# EAGLE design mini_Quad_v01 (EAGLE 9.0.1)
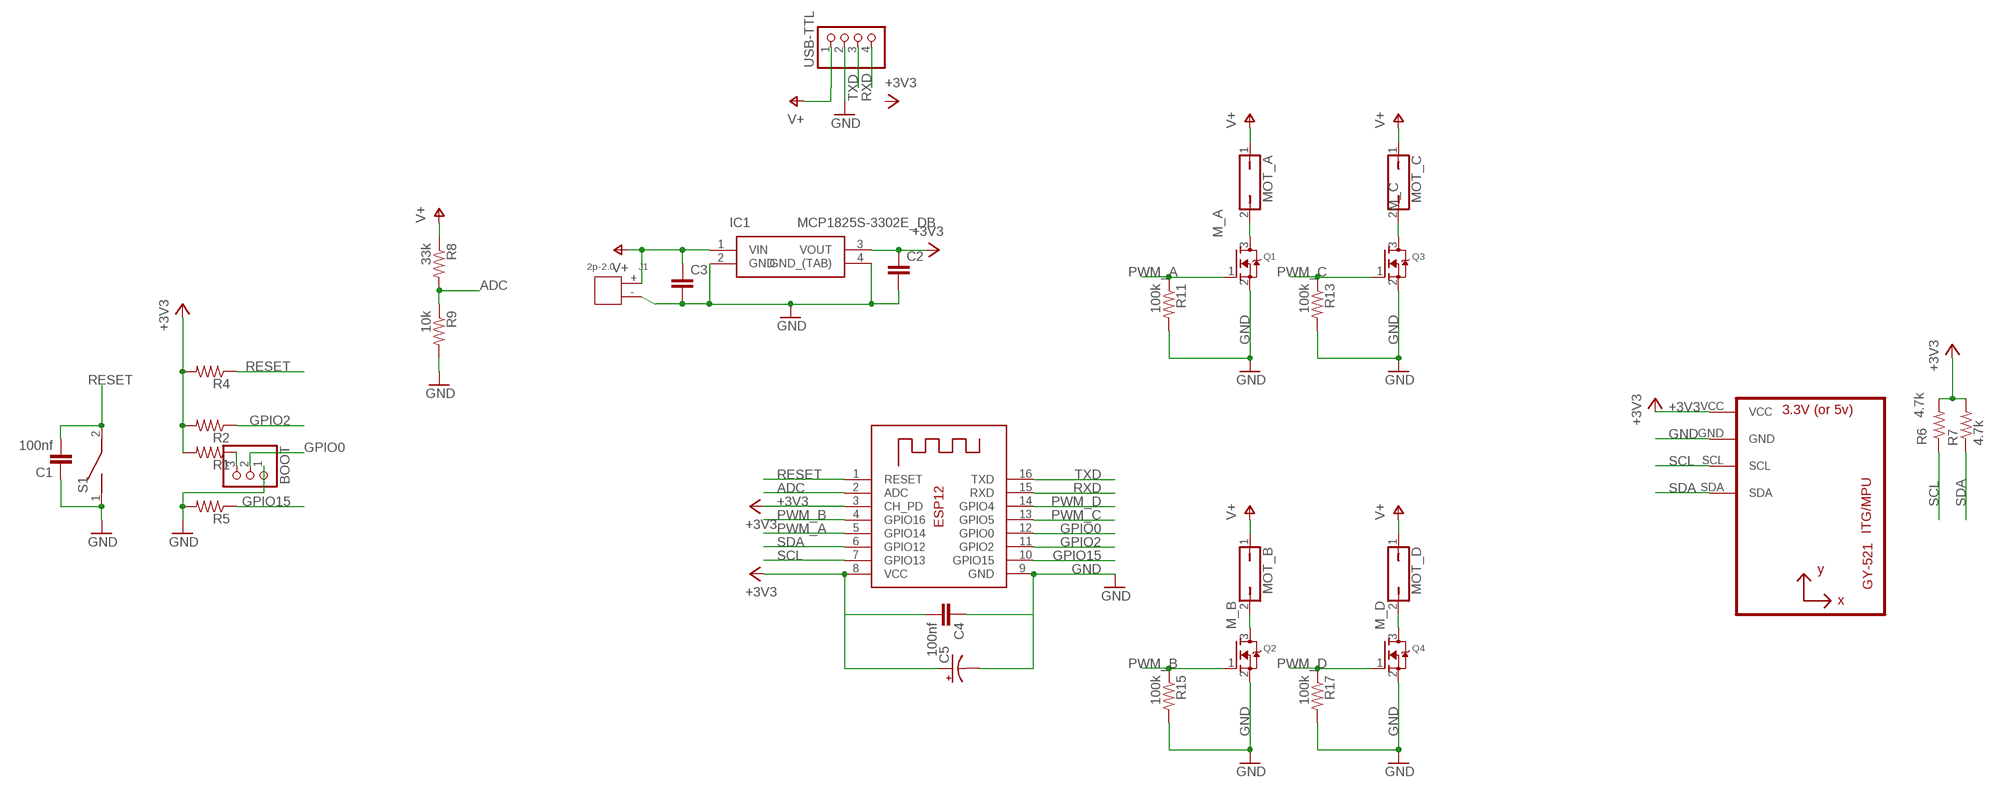
[diagram p0: schematic, sheet 1]

## Parts
BOOT  PINHD-1X3  [1X03]
C1  100nf  C-EU050-024X044  [C050-024X044]
C2  C-EUC1206K  [C1206K]
C3  C-EUC1206K  [C1206K]
C4  100nf  C-EU050-024X044  [C050-024X044]
C5  CPOL-USB/3528-21W  [B/3528-21W]
IC1  MCP1825S-3302E_DB  [SOT230P700X180-4N]
J1  2p-2.0  DIP-JST-2P-2.0  [H2-2.0-6X4.5MM]
MOT_A  JP1Q  [JP1]
MOT_B  JP1Q  [JP1]
MOT_C  JP1Q  [JP1]
MOT_D  JP1Q  [JP1]
Q1  MOSFET-NTO252  [TO252]
Q2  MOSFET-NTO252  [TO252]
Q3  MOSFET-NTO252  [TO252]
Q4  MOSFET-NTO252  [TO252]
R1  R-US_R1206W  [R1206W]
R2  R-US_0204/5  [0204/5]
R4  R-US_0204/7  [0204/7]
R5  R-US_0204/5  [0204/5]
R6  4.7k  R-US_0204/5  [0204/5]
R7  4.7k  R-US_0204/7  [0204/7]
R8  33k  R-US_0207/10  [0207/10]
R9  10k  R-US_0204/5  [0204/5]
R11  100k  R-US_0204/5  [0204/5]
R13  100k  R-US_0204/5  [0204/5]
R15  100k  R-US_0207/10  [0207/10]
R17  100k  R-US_0204/5  [0204/5]
S1  DS01  [DS-01]
U1  GY-521MPU6050  [GY-521]
USB-TTL  PINHD-1X4  [1X04]
X1  ESP-12  [ESP-12]

## Nets
+3V3: C2.1 C4.2 C5.+ IC1.3(VOUT) R1.2 R2.2 R4.2 R6.2 R7.2 U1.VCC X1.3(CH_PD) X1.8(VCC)
ADC: R8.2 R9.1 X1.2(ADC)
GND: BOOT.1 C1.1 C2.2 C3.2 C4.1 C5.- IC1.2(GND) IC1.4(GND_(TAB)) J1.- Q1.2(S) Q2.2(S) Q3.2(S) Q4.2(S) R5.2 R9.2 R11.2 R13.2 R15.2 R17.2 S1.1 U1.GND USB-TTL.2 X1.9(GND)
GPIO0: BOOT.2 X1.12(GPIO0)
GPIO2: R2.1 X1.11(GPIO2)
GPIO15: R5.1 X1.10(GPIO15)
M_A [power]: MOT_A.2 Q1.3(D)
M_B: MOT_B.2 Q2.3(D)
M_C [power]: MOT_C.2 Q3.3(D)
M_D: MOT_D.2 Q4.3(D)
N$1: BOOT.3 R1.1
PWM_A: Q1.1(G) R11.1 X1.5(GPIO14)
PWM_B: Q2.1(G) R15.1 X1.4(GPIO16)
PWM_C: Q3.1(G) R13.1 X1.13(GPIO5)
PWM_D: Q4.1(G) R17.1 X1.14(GPIO4)
RESET: C1.2 R4.1 S1.2 X1.1(RESET)
RXD: USB-TTL.4 X1.15(RXD)
SCL: R6.1 U1.SCL X1.7(GPIO13)
SDA: R7.1 U1.SDA X1.6(GPIO12)
TXD: USB-TTL.3 X1.16(TXD)
V+ [power]: C3.1 IC1.1(VIN) J1.+ MOT_A.1 MOT_B.1 MOT_C.1 MOT_D.1 R8.1 USB-TTL.1

## Library data of the parts
BOOT = mini_Quad_v01:PINHD-1X3: PIN HEADER
C1 C4 = mini_Quad_v01:C-EU: CAPACITOR, European symbol; SPICEPREFIX: C
C2 C3 = rcl:C-EU: CAPACITOR, European symbol; SPICEPREFIX: C
C5 = mini_Quad_v01:CPOL-US: POLARIZED CAPACITOR, American symbol
IC1 = mini_Quad_v01:MCP1825S-3302E_DB: LDO Regulator 500mA 3.3V SOT223-3 Microchip MCP1825S-3302E/DB, LDO Voltage Regulator, 0.5A, 3.3 V 0.5%, 2.1 6 Vin, 4-Pin SOT-223 Source: Datasheet <http://docs-europe.electrocomponents.com/webdocs/137e/0900766b8137ed40.pdf>; ALLIED_NUMBER: 70046538; ARROW_PART_NUMBER: MCP1825S-3302E/DB; DESCRIPTION: LDO Regulator 500mA 3.3V SOT223-3 Microchip MCP1825S-3302E/DB, LDO Voltage Regulator, 0.5A, 3.3 V 0.5%, 2.1 6 Vin, 4-Pin SOT-223; HEIGHT: 1.8mm; MANUFACTURER_NAME: Microchip; MANUFACTURER_PART_NUMBER: MCP1825S-3302E/DB; RS_PART_NUMBER: 9115520
J1 = mini_Quad_v01:DIP-JST-2P-2.0: 320110049
MOT_A MOT_B MOT_C MOT_D = mini_Quad_v01:JP1Q: JUMPER
Q1-Q4 = mini_Quad_v01:MOSFET-N: N-Channel Mosfet 2N7002E - 60V 260mA SOT23 [Digikey: 2N7002ET1GOSTR-ND] - REEL BSH103 - 30V 850mA SOT23 [Digikey: 568-5013-1-ND]
R1 R2 R4-R9 R11 R13 R15 R17 = mini_Quad_v01:R-US_: RESISTOR, American symbol; SPICEPREFIX: R
S1 = mini_Quad_v01:DS01: DIL/CODE SWITCH; OC_FARNELL: unknown; OC_NEWARK: unknown
U1 = mini_Quad_v01:GY-521
USB-TTL = mini_Quad_v01:PINHD-1X4: PIN HEADER
X1 = mini_Quad_v01:ESP-12

## Net classes
1 power: width 1.27 mm

## Board
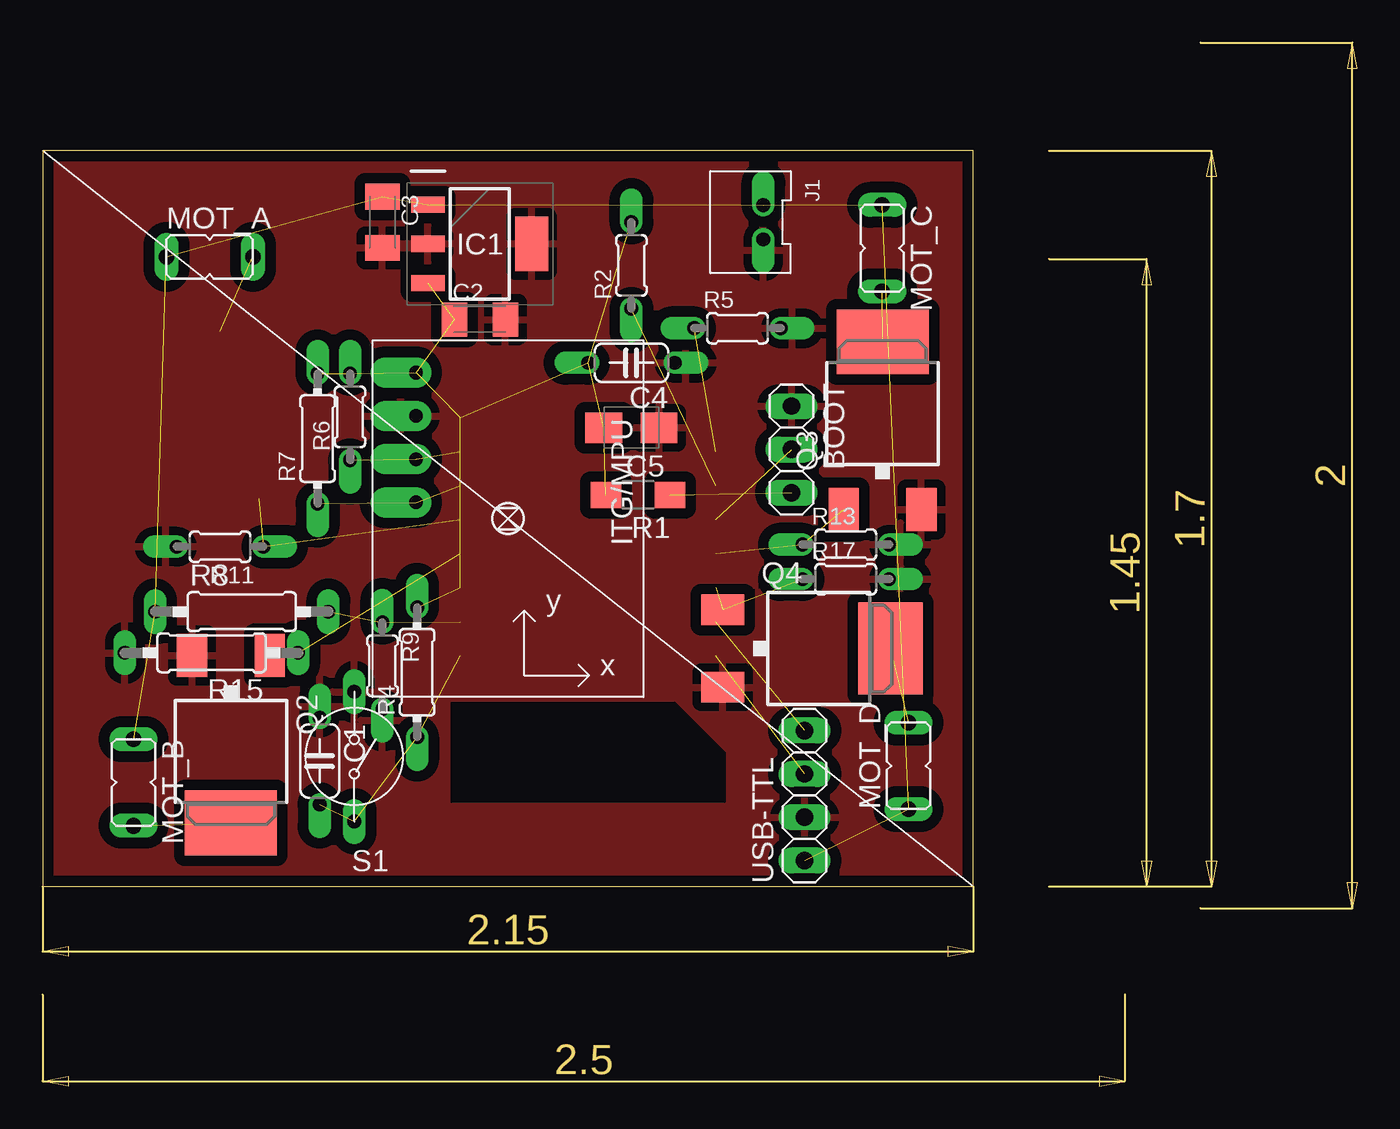
[diagram p1: board, top side]
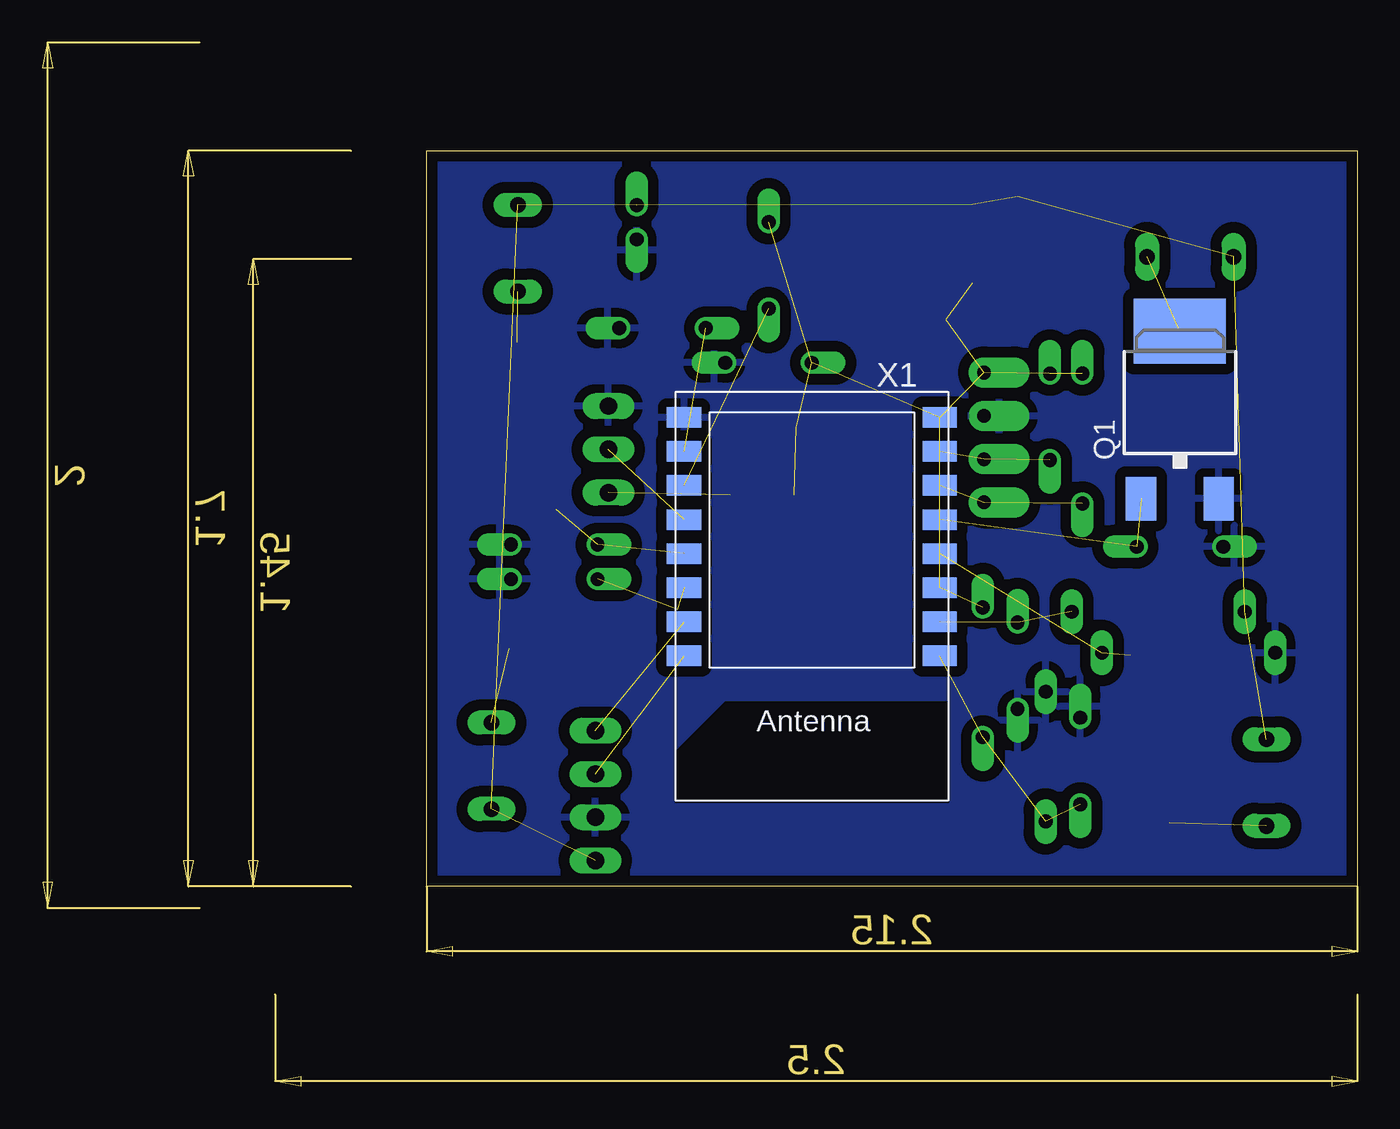
[diagram p2: board, bottom side, seen from below]

Size 54.61 x 43.18 mm. Coordinates in mm from the lower left corner, seen from the top.
Outline: 0,0 54.61,0 54.61,43.18 0,43.18 0,0
Copper layers (1*16): Top 0.035mm / dielectric 1.5mm / Bottom 0.035mm
Design rules "default_25th": minimum track width 25mil, minimum drill 30mil, track to track 25mil, track to pad 25mil, pad to pad 25mil, via to via 25mil, smd to smd 6mil, copper to edge 25mil, drill to drill 30mil, minimum pad ring 10mil, minimum via ring 8mil, stop-mask expansion 4mil, vias tented up to drill 0mil, thermal gap 20mil

### Footprints (pad centres in the part's own frame; a part is rotated, then mirrored left to right if it is on the bottom)
1X03 = drill 1.016 long: 1 -2.54,0; 2 0,0; 3 2.54,0
C050-024X044 = drill 0.813 offset: 1 -2.54,0; 2 2.54,0
C1206K = smd 1.5 x 2: 1 -1.5,0; 2 1.5,0
B/3528-21W = smd 2.15 x 1.8: + 1.625,0; - -1.625,0
SOT230P700X180-4N = smd 1.95 x 0.95: 1 -3.05,2.3; 2 -3.05,0; 3 -3.05,-2.3 | smd 1.95 x 3.2: 4 3.05,0
H2-2.0-6X4.5MM = drill 0.8 pad 1.3 offset: + -1,0.75; - 1,0.75
JP1 = drill 0.914 long: 1 0,-2.54; 2 0,2.54
TO252 = smd 1.778 x 2.54: 1 -2.28,-4.8; 2 2.28,-4.8 | smd 5.4 x 3.81: 3 0,5.04
R1206W = smd 1.8 x 1.524: 1 -1.88,0; 2 1.88,0
0204/5 = drill 0.813 offset: 1 -2.54,0; 2 2.54,0
0204/7 = drill 0.813 offset: 1 -3.81,0; 2 3.81,0
0207/10 = drill 0.813 long: 1 -5.08,0; 2 5.08,0
DS-01 = drill 0.813 long: 1 0,-3.81; 2 0,3.81
GY-521 = drill 0.8 pad 1.778 offset: GND -5.397,6.032; SCL -5.397,3.493; SDA -5.397,0.953; VCC -5.397,8.572
1X04 = drill 1.016 long: 1 -3.81,0; 2 -1.27,0; 3 1.27,0; 4 3.81,0
ESP-12 = smd 2 x 1.2: 1 -7.5,4.5; 2 -7.5,2.5; 3 -7.5,0.5; 4 -7.5,-1.5; 5 -7.5,-3.5; 6 -7.5,-5.5; 7 -7.5,-7.5; 8 -7.5,-9.5; 9 7.5,-9.5; 10 7.5,-7.5; 11 7.5,-5.5; 12 7.5,-3.5; 13 7.5,-1.5; 14 7.5,0.5; 15 7.5,2.5; 16 7.5,4.5

### Placement (x,y rotation side)
BOOT  43.94,25.65 270 top
C1  16.26,7.37 270 top
C2  25.65,33.27 0 top
C3  19.94,38.99 270 top
C4  34.54,30.73 180 top
C5  34.54,26.92 180 top
IC1  25.65,37.72 0 top
J1  41.53,38.99 270 top
MOT_A  9.8,36.96 270 top
MOT_B  5.33,6.1 180 top
MOT_C  49.25,37.47 180 top
MOT_D  50.8,7.08 0 top
Q1  10.41,27.56 0 bottom
Q2  11.05,8.76 180 top
Q3  49.28,26.92 0 top
Q4  44.7,13.97 270 top
R1  34.92,22.99 180 top
R2  34.54,36.45 90 top
R4  21.97,12.57 90 top
R5  40.77,32.77 0 top
R6  18.03,27.56 90 top
R7  16.13,26.29 90 top
R8  11.68,16.13 0 top
R9  19.94,12.95 270 top
R11  10.41,19.94 180 top
R13  47.12,20.07 0 top
R15  9.91,13.72 180 top
R17  47.12,18.03 0 top
S1  18.29,7.62 180 top
U1  27.3,21.59 0 top
USB-TTL  44.7,5.33 90 top
X1  32,18.03 180 bottom

### Tracks (layer width: path | path; a pad name or v marks a point on that pad's centre or on a via)
+3V3  (11 unrouted)
ADC  (2 unrouted)
GND
  pour Bottom: -12.7,73.66 -12.7,-7.62 104.14,-7.62 104.14,73.66
  pour Top: -5.08,81.28 76.2,81.28 76.2,-17.78 -5.08,-17.78
GPIO0  (1 unrouted)
GPIO2  (1 unrouted)
GPIO15  (1 unrouted)
M_A  (1 unrouted)
M_B  (1 unrouted)
M_C  (1 unrouted)
M_D  (1 unrouted)
N$1  (1 unrouted)
PWM_A  (2 unrouted)
PWM_B  (2 unrouted)
PWM_C  (2 unrouted)
PWM_D  (2 unrouted)
RESET  (3 unrouted)
RXD  (1 unrouted)
SCL  (2 unrouted)
SDA  (2 unrouted)
TXD  (1 unrouted)
V+  (8 unrouted)